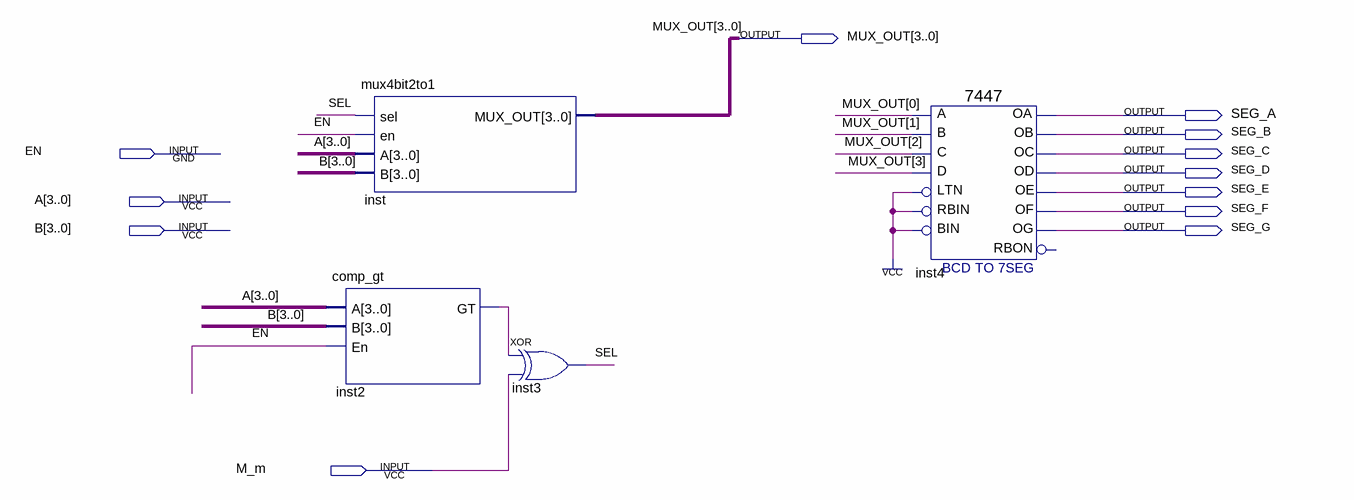
[diagram p0: schematic sheet]
// Quartus schematic PR2_DISPLAY_MAYOR_MENOR.bdf as structural Verilog: 4 symbols, 12 pins
module PR2_DISPLAY_MAYOR_MENOR (
  input  EN,
  input  [3:0] A,
  input  [3:0] B,
  input  M_m,
  output [3:0] MUX_OUT,
  output SEG_A,
  output SEG_B,
  output SEG_C,
  output SEG_D,
  output SEG_E,
  output SEG_F,
  output SEG_G
);

  wire inst2_gt, SEL;

  mux4bit2to1 inst (.sel(SEL), .en(EN), .A(A), .B(B), .MUX_OUT(MUX_OUT));
  comp_gt inst2 (.A(A), .B(B), .En(EN), .GT(inst2_gt));
  xor inst3 (SEL, inst2_gt, M_m);
  \7447  inst4 (
    .LTN(1'b1), .B(MUX_OUT[1]), .C(MUX_OUT[2]), .D(MUX_OUT[3]), .RBIN(1'b1), .BIN(1'b1), .A(MUX_OUT[0]),
    .OB(SEG_B), .OC(SEG_C), .OE(SEG_E), .OD(SEG_D), .OF(SEG_F), .OG(SEG_G), .OA(SEG_A));  // open: RBON
endmodule
